# EAGLE schematic rtu (EAGLE 9.3.0)
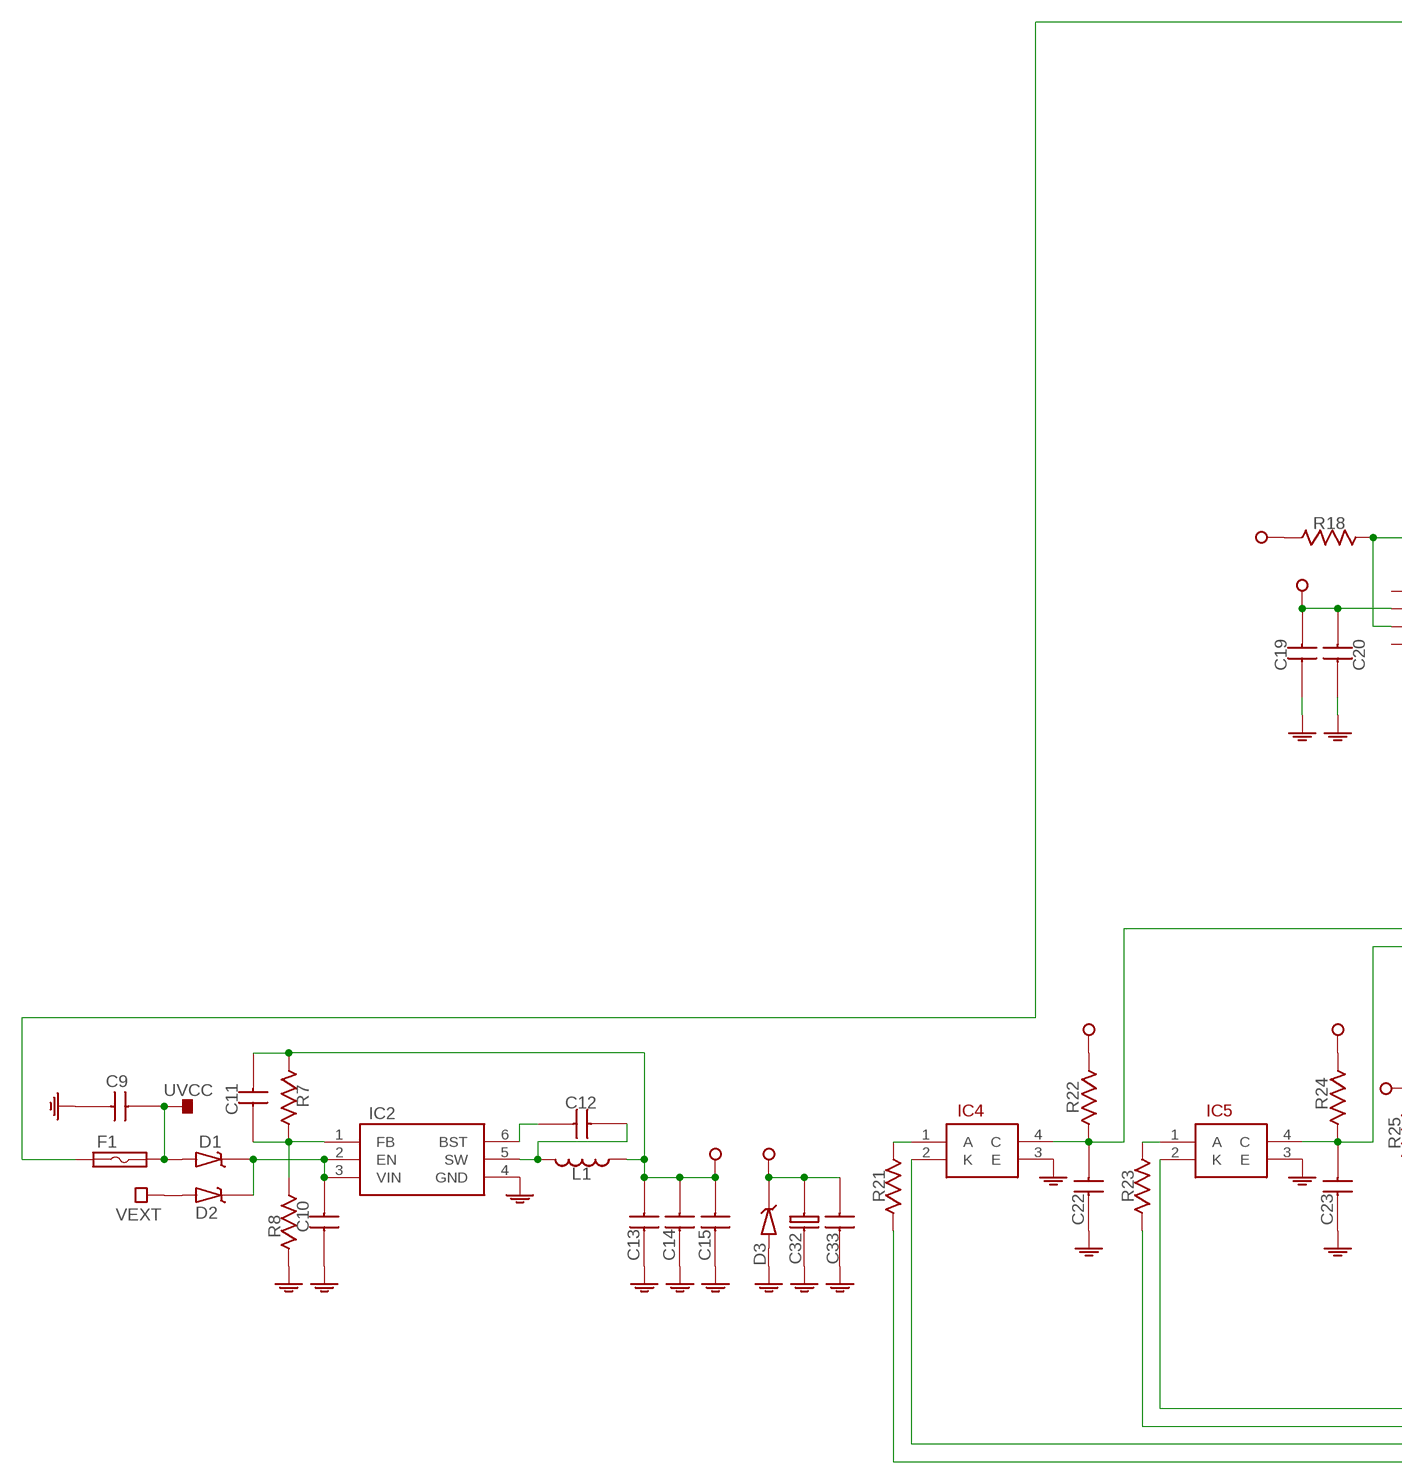
[diagram p0: schematic, sheet 1, part 1 of 2]
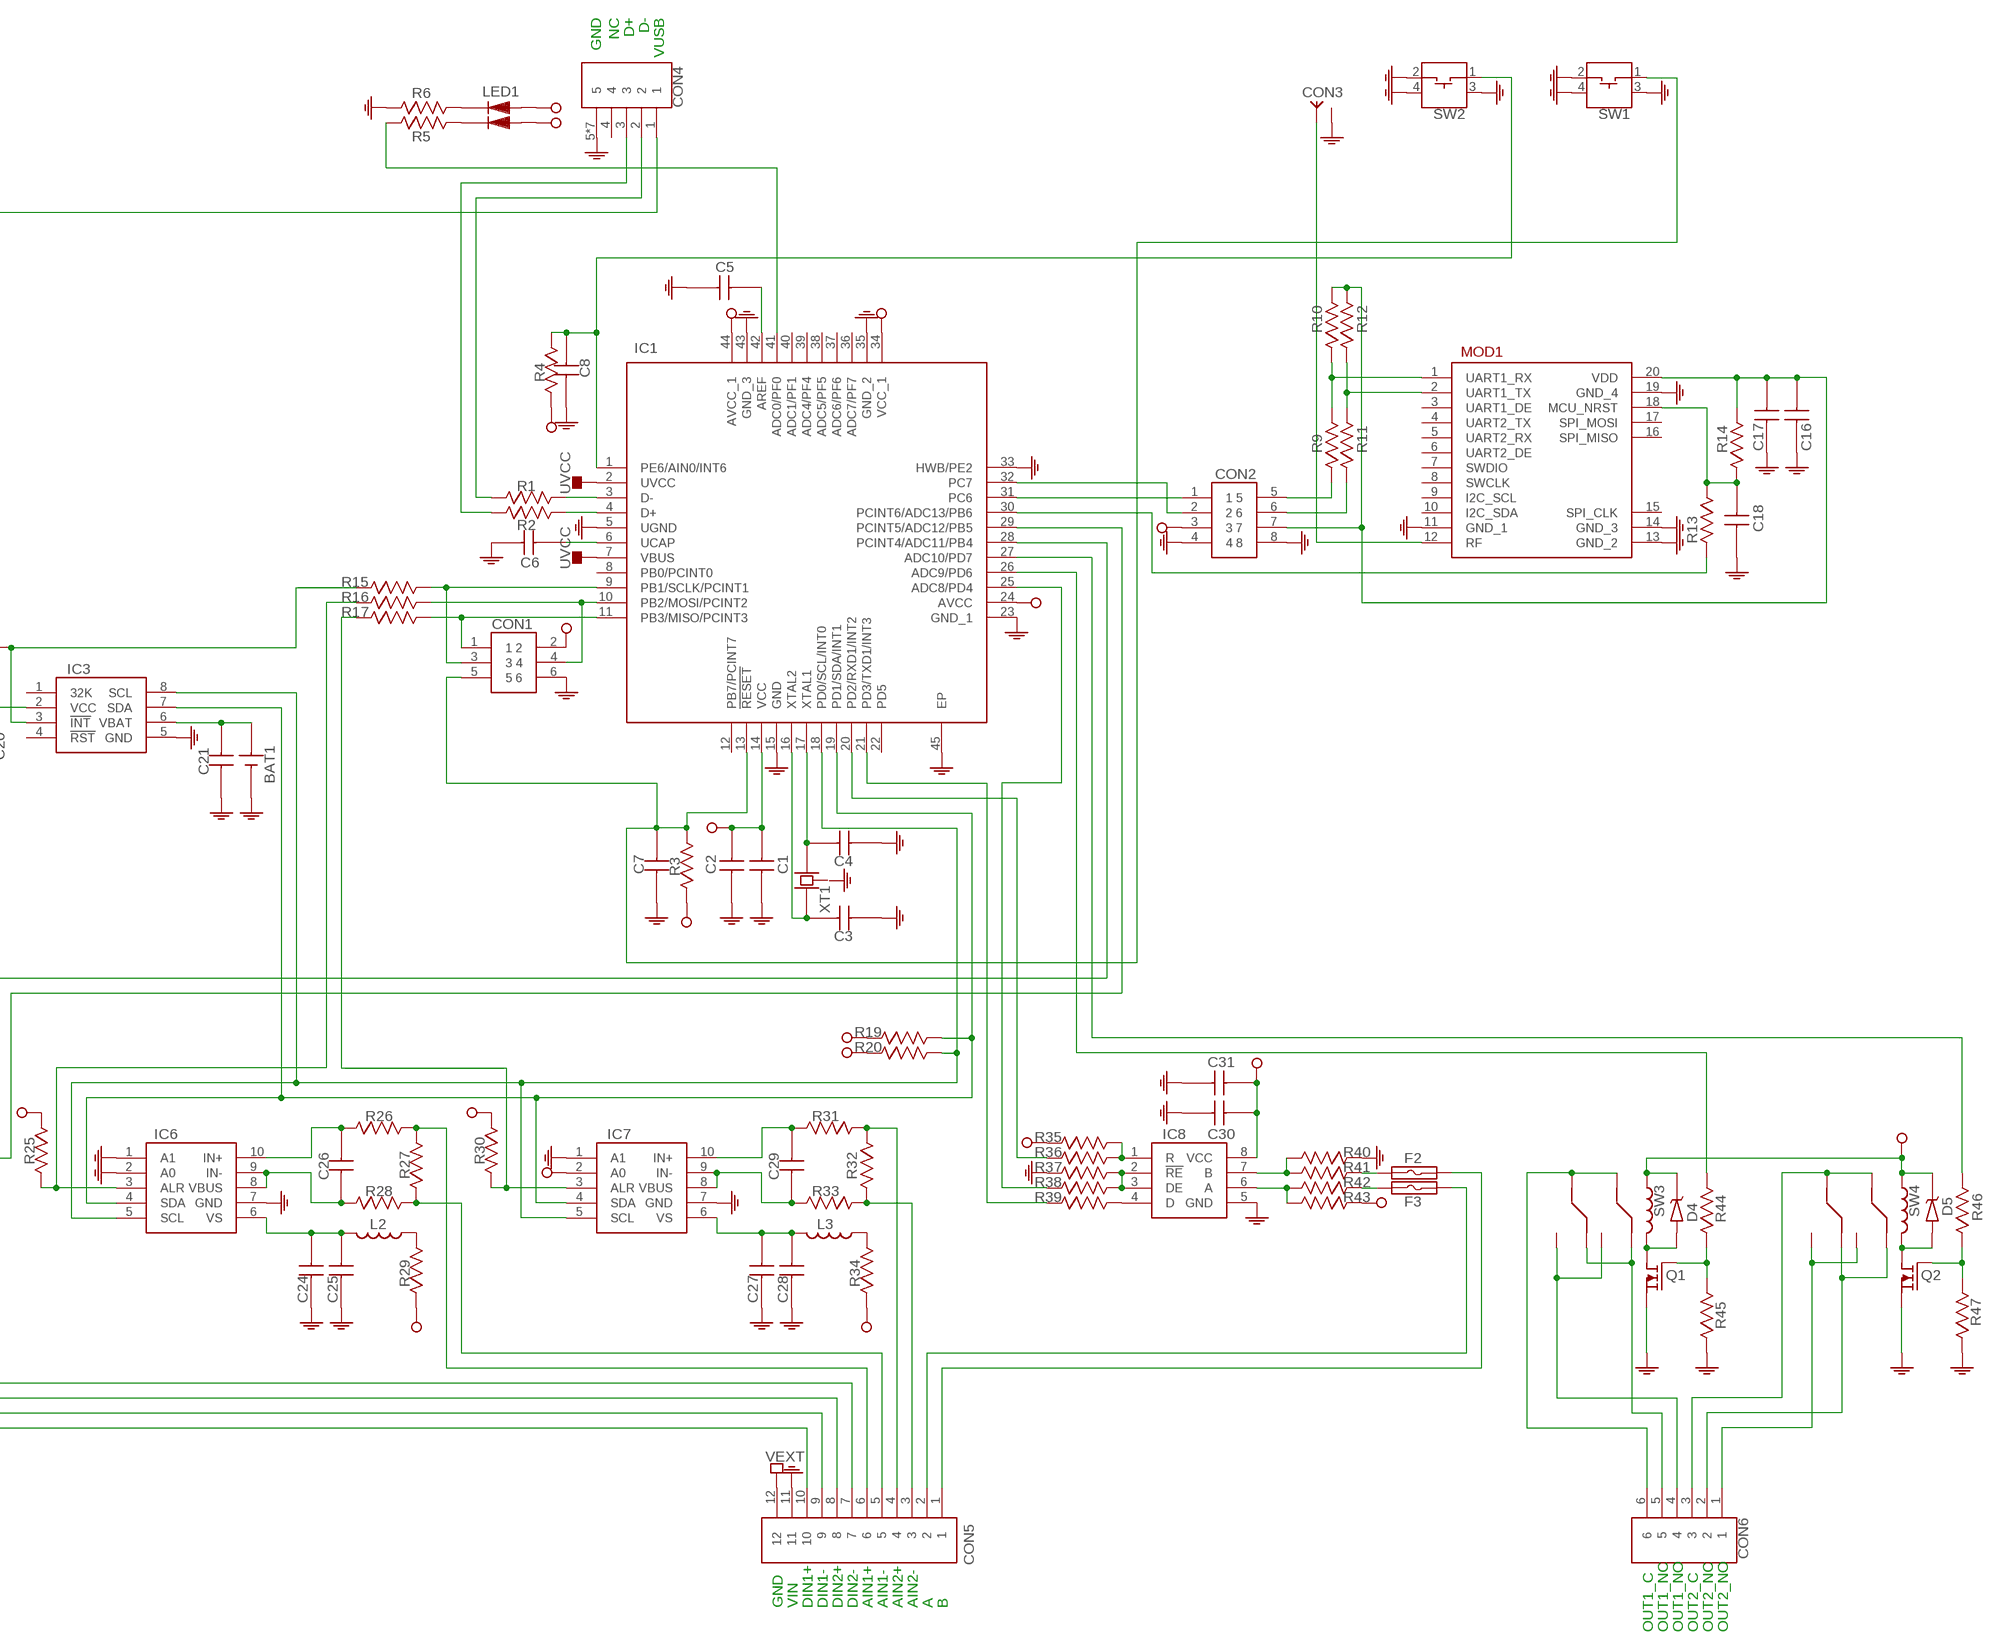
[diagram p1: schematic, sheet 1, part 2 of 2]

## Parts
BAT1  BAT-1220-BC501SM  [BAT-1220-BC501SM]
C1  CAPACITOR-0603  [0603]
C2  CAPACITOR-0603  [0603]
C3  CAPACITOR-0603  [0603]
C4  CAPACITOR-0603  [0603]
C5  CAPACITOR-0603  [0603]
C6  CAPACITOR-0603  [0603]
C7  CAPACITOR-0603  [0603]
C8  CAPACITOR-0603  [0603]
C9  CAPACITOR-0603  [0603]
C10  CAPACITOR-1206  [1206]
C11  CAPACITOR-0603  [0603]
C12  CAPACITOR-0603  [0603]
C13  CAPACITOR-1206  [1206]
C14  CAPACITOR-1206  [1206]
C15  CAPACITOR-0603  [0603]
C16  CAPACITOR-0603  [0603]
C17  CAPACITOR-0603  [0603]
C18  CAPACITOR-0603  [0603]
C19  CAPACITOR-0603  [0603]
C20  CAPACITOR-0603  [0603]
C21  CAPACITOR-0603  [0603]
C22  CAPACITOR-0603  [0603]
C23  CAPACITOR-0603  [0603]
C24  CAPACITOR-0603  [0603]
C25  CAPACITOR-0603  [0603]
C26  CAPACITOR-0603  [0603]
C27  CAPACITOR-0603  [0603]
C28  CAPACITOR-0603  [0603]
C29  CAPACITOR-0603  [0603]
C30  CAPACITOR-0603  [0603]
C31  CAPACITOR-0603  [0603]
C32  CAPACITOR-SMD-8  [CAPACITOR-SMD-8]
C33  CAPACITOR-0603  [0603]
CON1  ISP  [ISP]
CON2  HEADER-8P-2R-DIP-2_54MM  [HEADER-8P-2R-DIP-2_54MM]
CON3  SMA-RF  [SMA-RF]
CON4  USB-MICRO-B-SMD  [USB-MICRO-B-SMD]
CON5  KF2EDGR-3.5-12P  [KF2EDGR-3.5-12P]
CON6  KF2EDGR-3.5-6P  [KF2EDGR-3.5-6P]
D1  DIODE-SCHOTTKY  [SOD123-DIODE]
D2  DIODE-SCHOTTKY  [SOD123-DIODE]
D3  ZENER-SOD123  [SOD123-DIODE]
D4  DIODE-SCHOTTKY  [SOD123-DIODE]
D5  DIODE-SCHOTTKY  [SOD123-DIODE]
F1  FUSE-1206  [1206]
F2  FUSE-1206  [1206]
F3  FUSE-1206  [1206]
IC1  ATMEGA32U4-MU  [QFN-44]
IC2  AP63200  [SOT23-6]
IC3  DS3231M  [SOIC-8]
IC4  OPTO-SMD  [OPTO-SMD]
IC5  OPTO-SMD  [OPTO-SMD]
IC6  INA226  [VSSOP-10]
IC7  INA226  [VSSOP-10]
IC8  IC-485-HALF  [SOIC-8]
L1  INDUCTOR-0520-0630  [INDUCTOR-0520-0630]
L2  INDUCTOR-0805  [0805]
L3  INDUCTOR-0805  [0805]
LED1  LED-HOLDER-2P  [LED-HOLDER-2P]
MOD1  RAK4200  [RAK4200]
Q1  N-MOSFET  [SOT23-3]
Q2  N-MOSFET  [SOT23-3]
R1  RESISTOR-0603  [0603]
R2  RESISTOR-0603  [0603]
R3  RESISTOR-0603  [0603]
R4  RESISTOR-0603  [0603]
R5  RESISTOR-0603  [0603]
R6  RESISTOR-0603  [0603]
R7  RESISTOR-0603  [0603]
R8  RESISTOR-0603  [0603]
R9  RESISTOR-0603  [0603]
R10  RESISTOR-0603  [0603]
R11  RESISTOR-0603  [0603]
R12  RESISTOR-0603  [0603]
R13  RESISTOR-0603  [0603]
R14  RESISTOR-0603  [0603]
R15  RESISTOR-0603  [0603]
R16  RESISTOR-0603  [0603]
R17  RESISTOR-0603  [0603]
R18  RESISTOR-0603  [0603]
R19  RESISTOR-0603  [0603]
R20  RESISTOR-0603  [0603]
R21  RESISTOR-0805  [0805]
R22  RESISTOR-0603  [0603]
R23  RESISTOR-0805  [0805]
R24  RESISTOR-0603  [0603]
R25  RESISTOR-0603  [0603]
R26  RESISTOR-0603  [0603]
R27  RESISTOR-1206  [1206]
R28  RESISTOR-0603  [0603]
R29  RESISTOR-0603  [0603]
R30  RESISTOR-0603  [0603]
R31  RESISTOR-0603  [0603]
R32  RESISTOR-1206  [1206]
R33  RESISTOR-0603  [0603]
R34  RESISTOR-0603  [0603]
R35  RESISTOR-0603  [0603]
R36  RESISTOR-0603  [0603]
R37  RESISTOR-0603  [0603]
R38  RESISTOR-0603  [0603]
R39  RESISTOR-0603  [0603]
R40  RESISTOR-0603  [0603]
R41  RESISTOR-0805  [0805]
R42  RESISTOR-0805  [0805]
R43  RESISTOR-0603  [0603]
R44  RESISTOR-0603  [0603]
R45  RESISTOR-0603  [0603]
R46  RESISTOR-0603  [0603]
R47  RESISTOR-0603  [0603]
SW1  B3F-3150-52-55  [B3F-3150-52-55]
SW2  B3F-3150-52-55  [B3F-3150-52-55]
SW3  HK19F  [HK19F]
SW4  HK19F  [HK19F]
XT1  CRYSTAL-5032-4P  [CRYSTAL-5032-4P]

## Nets
GND: BAT1.- C1.1 C2.1 C3.1 C4.1 C5.1 C6.1 C7.1 C8.2 C9.1 C10.1 C13.1 C14.1 C15.1 C16.1 C17.1 C18.1 C19.1 C20.1 C21.1 C22.1 C23.1 C24.1 C25.1 C27.1 C28.1 C30.1 C31.1 C32.1 C33.1 CON1.6 CON2.4 CON2.8 CON3.2(GND) CON3.3(GND) CON3.4(GND) CON3.5(GND) CON4.5 CON4.6 CON4.7 CON4.8 CON4.9 CON4.10 CON4.11 CON5.11 D3.2(A) IC1.5(UGND) IC1.15(GND) IC1.23(GND_1) IC1.33(HWB/PE2) IC1.35(GND_2) IC1.43(GND_3) IC1.45(EP) IC2.4(GND) IC3.5(GND) IC4.3(E) IC5.3(E) IC6.1(A1) IC6.2(A0) IC6.7(GND) IC7.1(A1) IC7.7(GND) IC8.5(GND) MOD1.11(GND_1) MOD1.13(GND_2) MOD1.14(GND_3) MOD1.19(GND_4) Q1.2(S) Q2.2(S) R6.1 R8.1 R37.1 R40.1 R45.1 R47.1 SW1.2 SW1.3 SW1.4 SW2.2 SW2.3 SW2.4
N$1: IC1.41(ADC0/PF0) R5.1
N$2: C18.2 MOD1.18(MCU_NRST) R13.1 R14.1
N$3: CON1.1 IC1.11(PB3/MISO/PCINT3) R17.2
N$4: CON3.1(ANT) MOD1.12(RF)
N$5: CON2.2 IC1.32(PC7)
N$6: MOD1.1(UART1_RX) R9.2 R10.1
N$7: MOD1.2(UART1_TX) R11.2 R12.1
N$8: LED1.1(K1) R6.2
N$9: CON1.4 IC1.10(PB2/MOSI/PCINT2) R16.2
N$10: C3.2 IC1.16(XTAL2) XT1.1
N$11: CON2.1 IC1.31(PC6)
N$12: C4.2 IC1.17(XTAL1) XT1.3
N$13: C16.2 C17.2 CON2.7 MOD1.20(VDD) R10.2 R12.2 R14.2
N$14: CON2.5 R9.1
N$15: LED1.3(K2) R5.2
N$16: CON2.6 R11.1
N$17: C29.1 IC7.8(VBUS) IC7.9(IN-) R33.2
N$18: CON4.2 R1.1
N$19: CON4.3 R2.1
N$20: IC4.1(A) R21.2
N$21: C29.2 IC7.10(IN+) R31.2
N$22: IC1.30(PCINT6/ADC13/PB6) R13.2
N$23: IC6.3(ALR) R16.1 R25.2
N$24: IC1.27(ADC10/PD7) R46.2
N$25: IC7.3(ALR) R17.1 R30.2
N$26: Q2.1(G) R46.1 R47.2
N$27: L3.1 R34.2
N$28: D5.2(A) Q2.3(D) SW4.L2
N$29: C8.1 IC1.1(PE6/AIN0/INT6) R4.1 SW2.1
N$30: CON5.4 R31.1 R32.1
N$31: C5.2 IC1.42(AREF)
N$32: C23.2 IC1.29(PCINT5/ADC12/PB5) IC5.4(C) R24.2
N$33: IC5.1(A) R23.2
N$34: C6.2 IC1.6(UCAP)
N$35: C22.2 IC1.28(PCINT4/ADC11/PB4) IC4.4(C) R22.2
N$36: Q1.1(G) R44.1 R45.2
N$37: D4.2(A) Q1.3(D) SW3.L2
N$38: IC1.26(ADC9/PD6) R44.2
N$39: CON6.6 SW3.C1 SW3.C2
N$40: CON5.3 R32.2 R33.1
N$41: C7.2 CON1.5 IC1.13(!RESET) R3.2 SW1.1
N$42: C27.2 C28.2 IC7.6(VS) L3.2
N$43: IC1.3(D-) R1.2
N$44: IC1.4(D+) R2.2
N$45: CON1.3 IC1.9(PB1/SCLK/PCINT1) R15.2
N$46: CON5.2 F3.1
N$47: IC8.1(R) R35.2 R36.2
N$48: IC8.4(D) R39.2
N$49: CON5.7 IC5.2(K)
N$50: CON5.9 IC4.2(K)
N$51: IC8.7(B) R40.2 R41.2
N$52: IC8.6(A) R42.2 R43.2
N$53: IC8.2(!RE) IC8.3(DE) R37.2 R38.2
N$54: F3.2 R42.1
N$55: CON5.8 R23.1
N$56: CON4.1 F1.1
N$57: C10.2 D1.1(K) D2.1(K) IC2.2(EN) IC2.3(VIN)
N$58: BAT1.+ C21.2 IC3.6(VBAT)
N$59: CON5.6 R26.2 R27.2
N$60: CON5.1 F2.1
N$61: IC1.20(PD2/RXD1/INT2) R36.1
N$62: IC1.21(PD3/TXD1/INT3) R39.1
N$63: IC1.25(ADC8/PD4) R38.1
N$65: C12.2 IC2.6(BST)
N$66: C12.1 IC2.5(SW) L1.2
N$67: CON6.4 SW3.NO1 SW3.NO2
N$68: C26.2 IC6.10(IN+) R26.1
N$69: C26.1 IC6.8(VBUS) IC6.9(IN-) R28.1
N$70: IC3.3(!INT) R15.1 R18.2
N$71: L2.1 R29.2
N$72: C11.1 IC2.1(FB) R7.2 R8.2
N$73: IC1.18(PD0/SCL/INT0) IC3.8(SCL) IC6.5(SCL) IC7.5(SCL) R20.2
N$74: CON6.5 SW3.NC1 SW3.NC2
N$75: CON6.3 SW4.C1 SW4.C2
N$76: CON6.2 SW4.NC1 SW4.NC2
N$77: C24.2 C25.2 IC6.6(VS) L2.2
N$78: CON6.1 SW4.NO1 SW4.NO2
N$79: IC1.19(PD1/SDA/INT1) IC3.7(SDA) IC6.4(SDA) IC7.4(SDA) R19.2
N$80: F2.2 R41.1
N$81: CON5.5 R27.1 R28.2
N$85: CON5.10 R21.1
UVCC: C9.2 D1.2(A) F1.2 IC1.2(UVCC) IC1.7(VBUS)
VCC: C1.2 C2.2 C11.2 C13.2 C14.2 C15.2 C19.2 C20.2 C30.2 C31.2 C32.2 C33.2 CON1.2 CON2.3 D3.1(K) D4.1(K) D5.1(K) IC1.14(VCC) IC1.24(AVCC) IC1.34(VCC_1) IC1.44(AVCC_1) IC3.2(VCC) IC7.2(A0) IC8.8(VCC) L1.1 LED1.2(A1) LED1.4(A2) R3.1 R4.2 R7.1 R18.1 R19.1 R20.1 R22.1 R24.1 R25.1 R29.1 R30.1 R34.1 R35.1 R43.1 SW3.L1 SW4.L1
VEXT: CON5.12 D2.2(A)
Unconnected: CON4.4 IC1.8(PB0/PCINT0) IC1.12(PB7/PCINT7) IC1.22(PD5) IC1.36(ADC7/PF7) IC1.37(ADC6/PF6) IC1.38(ADC5/PF5) IC1.39(ADC4/PF4) IC1.40(ADC1/PF1) IC3.1(32K) IC3.4(!RST) MOD1.3(UART1_DE) MOD1.4(UART2_TX) MOD1.5(UART2_RX) MOD1.6(UART2_DE) MOD1.7(SWDIO) MOD1.8(SWCLK) MOD1.9(I2C_SCL) MOD1.10(I2C_SDA) MOD1.15(SPI_CLK) MOD1.16(SPI_MISO) MOD1.17(SPI_MOSI)

## Notes on the sheet
- GND | NC | D+ | D- | VUSB
- GND | VIN | DIN1+ | DIN1- | DIN2+ | DIN2- | AIN1+ | AIN1- | AIN2+ | AIN2- | A | B
- OUT1_C | OUT1_NC | OUT1_NO | OUT2_C | OUT2_NC | OUT2_NO

## Power pins joined to a net without a drawn wire
GND: XT1.2(GND) XT1.4(GND)

## Library data of the parts
BAT1 = myparts:BAT-1220-BC501SM
C1-C9 C11 C12 C15-C31 C33 = myparts:CAPACITOR-0603
C10 C13 C14 = myparts:CAPACITOR-1206
C32 = myparts:CAPACITOR-SMD-8
CON1 = myparts:ISP
CON2 = myparts:HEADER-8P-2R-DIP-2_54MM
CON3 = myparts:SMA-RF
CON4 = myparts:USB-MICRO-B-SMD
CON5 = myparts:KF2EDGR-3.5-12P
CON6 = myparts:KF2EDGR-3.5-6P
D1 D2 D4 D5 = myparts:DIODE-SCHOTTKY
D3 = myparts:ZENER-SOD123
F1-F3 = myparts:FUSE-1206
IC1 = myparts:ATMEGA32U4-MU
IC2 = myparts:AP63200
IC3 = myparts:DS3231M
IC4 IC5 = myparts:OPTO-SMD
IC6 IC7 = myparts:INA226
IC8 = myparts:IC-485-HALF
L1 = myparts:INDUCTOR-0520-0630
L2 L3 = myparts:INDUCTOR-0805
LED1 = myparts:LED-HOLDER-2P
MOD1 = myparts:RAK4200
Q1 Q2 = myparts:N-MOSFET
R1-R20 R22 R24-R26 R28-R31 R33-R40 R43-R47 = myparts:RESISTOR-0603
R21 R23 R41 R42 = myparts:RESISTOR-0805
R27 R32 = myparts:RESISTOR-1206
SW1 SW2 = myparts:B3F-3150-52-55
SW3 SW4 = myparts:HK19F
XT1 = myparts:CRYSTAL-5032-4P